# Altium project Smart_Wifi_Control_System_Rev_A.1.0.PrjPcb
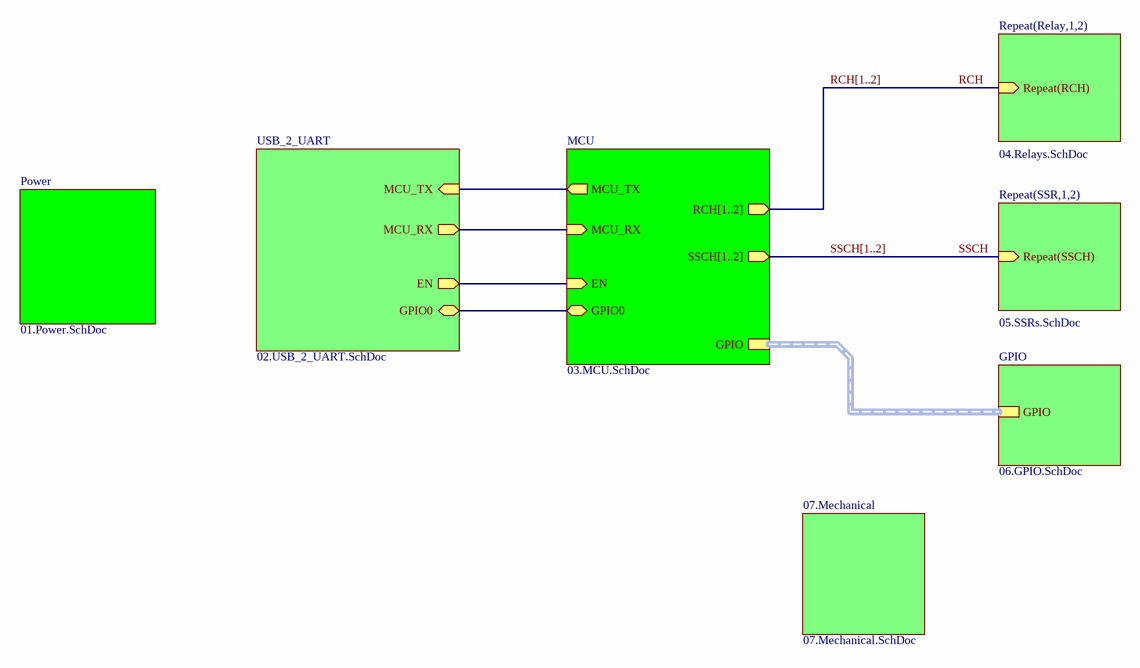
[diagram p0: 0.Main.SchDoc]
DrawnBy: H.M.K Shehan; Revision: A.1.0; Title: Smart_Wifi_Control_System_Rev_A.1.0
8 sheets, 90 parts. Net scope: hierarchical (ports join the sheet entries above them; power ports are global).
Board file: Layout_D0.PcbDoc
Sheets:
  0.Main.SchDoc
    Power = 01.Power.SchDoc
    Relay1 = 04.Relays.SchDoc
    Relay2 = 04.Relays.SchDoc
    SSR1 = 05.SSRs.SchDoc
    SSR2 = 05.SSRs.SchDoc
    USB_2_UART = 02.USB_2_UART.SchDoc
    MCU = 03.MCU.SchDoc
    GPIO = 06.GPIO.SchDoc
    07.Mechanical = 07.Mechanical.SchDoc

## Sheet 0.Main.SchDoc: Smart_Wifi_Control_System_Rev_A.1.0
size A4; DocumentNumber: 01; SheetNumber: 1; SheetTotal: 8; Page: Block Diagram

### Sub-sheets
07.Mechanical = 07.Mechanical.SchDoc: no entries
GPIO = 06.GPIO.SchDoc: GPIO (harness GPIO)
MCU = 03.MCU.SchDoc: EN (in), GPIO0 (bidir), GPIO (harness GPIO), MCU_TX (out), MCU_RX (in), RCH[1..2] (out), SSCH[1..2] (out)
Power = 01.Power.SchDoc: no entries
Repeat(Relay,1,2) = 04.Relays.SchDoc: Repeat(RCH) (in)
Repeat(SSR,1,2) = 05.SSRs.SchDoc: Repeat(SSCH) (in)
USB_2_UART = 02.USB_2_UART.SchDoc: MCU_RX (out), MCU_TX (in), EN (out), GPIO0 (bidir)

### Nets
EN: sheet USB_2_UART/EN, sheet MCU/EN
GPIO0: sheet USB_2_UART/GPIO0, sheet MCU/GPIO0
RCH: sheet Repeat(Relay,1,2)/Repeat(RCH)
RXD0: sheet USB_2_UART/MCU_RX, sheet MCU/MCU_RX
SSCH: sheet Repeat(SSR,1,2)/Repeat(SSCH)
TXD0: sheet USB_2_UART/MCU_TX, sheet MCU/MCU_TX

### Buses and harness runs
bus RCH[1..2] = sheet MCU/RCH[1..2]
bus SSCH[1..2] = sheet MCU/SSCH[1..2]
harness sheet GPIO/GPIO = sheet MCU/GPIO

### Notes on the sheet
- Title :
- Size:
- Date:
- Page :
- A4
- Number:
- Time:
- Revision:
- Sheet
- of
- Sheet Name :
- Drawn By :

## Sheet 01.Power.SchDoc: Smart_Wifi_Control_System_Rev_A.1.0
size A4; DocumentNumber: 02; SheetNumber: 2; SheetTotal: 8; Page: Power
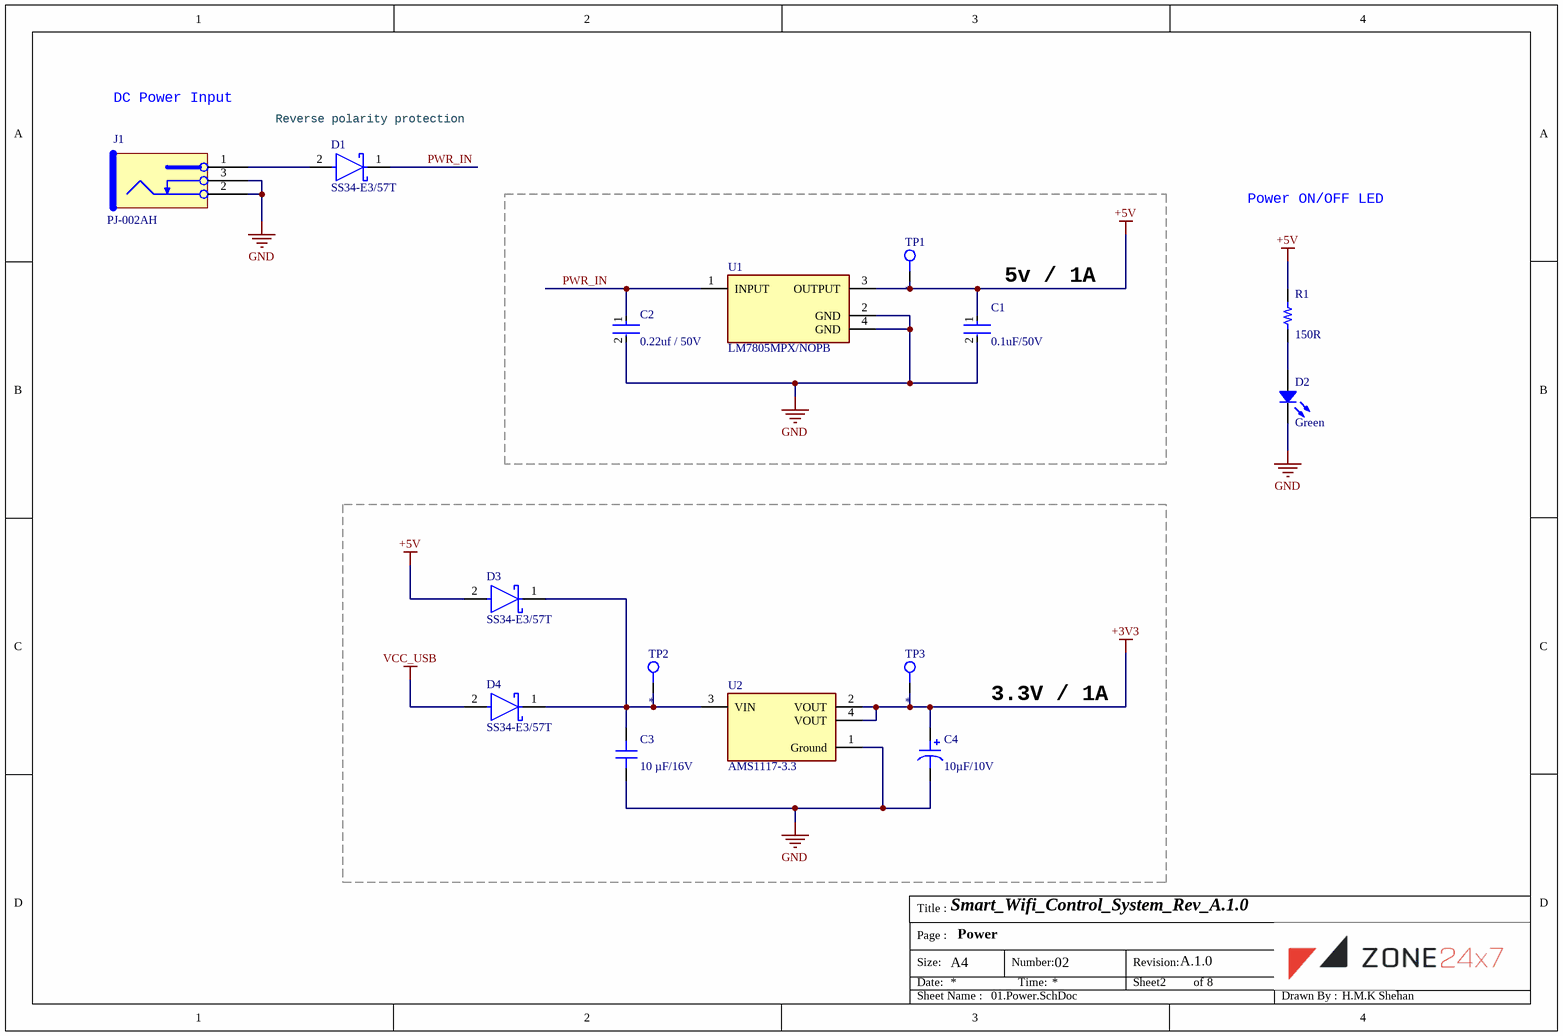
[diagram p1: 01.Power.SchDoc]

### Parts
C1  0.1uF/50V  [FP-RDE0M1-MFG]
C2  0.22uf / 50V  [FP-GRM31C-0_2-e0_3_0_8-IPC_B]
C3  10 µF/16V  [CAP 0603_1608]
C4  10µF/10V  [CAP POL 1411_3528]
D1  SS34-E3/57T  [FP-95402-MFG]
D2  Green  [LED 0805_2012 GREEN]
D3  SS34-E3/57T  [FP-95402-MFG]
D4  SS34-E3/57T  [FP-95402-MFG]
J1  PJ-002AH  [POWER_JACK_5.5_2.1MM_NS]
R1  150R  [RES 0603_1608]
TP1  *  [TP-2ED-1ID]
TP2  *  [TP-2ED-1ID]
TP3  *  [TP-2ED-1ID]
U1  LM7805MPX/NOPB  [FP-LM7805MPX-NOPB-MFG]
U2  AMS1117-3.3  [FP-AMS1117-IPC_C]

### Blocks framed on the sheet
5v / 1A: C1 C2 TP1 U1
3.3V / 1A: C3 C4 D3 D4 TP2 TP3 U2

### Nets
+3V3: C4.1 TP3.1 U2.2(VOUT) U2.4(VOUT)
+5V: C1.1 D3.2(A) R1.2 TP1.1 U1.3(OUTPUT)
GND: C1.2 C2.2 C3.1 C4.2 D2.2 J1.2 J1.3 U1.2(GND) U1.4(GND) U2.1(Ground)
VCC_USB: D4.2(A)  [project net VBUS]
PWR_IN: C2.1 D1.1(C) U1.1(INPUT)
NetC3_2: C3.2 D3.1(C) D4.1(C) TP2.1 U2.3(VIN)
NetD1_2: D1.2(A) J1.1
NetD2_1: D2.1 R1.1

### Notes on the sheet
- DC Power Input
- (near D1) Reverse polarity protection
- Power ON/OFF LED
- Title :
- Size:
- Date:
- Page :
- A4
- Number:
- Time:
- Revision:
- Sheet
- of
- Sheet Name :
- Drawn By :

### Library data of the parts
C1 = CMP-06035-051680-1: ±10% 100nF 4mm 5.5mm 5mm 50V Radial Leaded,P=5mm Ceramic Disc Capacitors ROHS; Manufacturer Part Number: RDER71H104K0M1H03A; Value: 0.1uF/50V; JLC Part Number: C527620
C2 = CMP-06035-010316-1: 50V 220nF C0G ±5% 1206 Multilayer Ceramic Capacitors MLCC - SMD/SMT ROHS; Part Number: GRM31C5C1H224JE02L; Value: 0.22uf / 50V; JLC Part Number: C464977
C3 = GRT188R61C106ME13D: 16V 10uF X5R ±20% 0603 Multilayer Ceramic Capacitors MLCC - SMD/SMT ROHS; manufacturer: Murata Electronics; Manufacturer Part Number: GRT188R61C106ME13D; Value: 10 µF/16V; JLC Part Number: C2168010
C4 = TAJB106K010TNJ: 10uF 10V 2.1Ω@100kHz ±10% 1411 Tantalum Capacitors ROHS; manufacturer: AVX Corporation; Manufacturer Part Number: TAJB106K010TNJ; Value: 10µF/10V; JLC Part Number: C1953247
D1 D3 D4 = CMP-02539-000012-1: 40V 500mV@3A 3A SMC(DO-214AB) Schottky Barrier Diodes (SBD) ROHS; Manufacturer Part Number: SS34-E3/57T; JLC Part Number: C13354
D2 = 5975316507F: 无色透明透镜 570nm -40℃~+90℃ Green-yellow 120° 0805 Light Emitting Diodes (LED) ROHS; Manufacturer Part Number: E6C0805YGAC1UDA; Manufacturer: EKINGLUX; Current - Test: 20mA; Color: Green; JLC Part Number: C375456
J1 = PJ-002AH: CONN PWR JACK 2.1X5.5MM HIGH CUR; Manufacturer Part Number: PJ-002AH; JLC Part Number: C2961147
R1 = CRCW0603150RFKEA: 100mW Thick Film Resistors 100V ±1% ±100ppm/℃ -55℃~+155℃ 150Ω 0603 Chip Resistor - Surface Mount ROHS; Manufacturer: Vishay Dale; Manufacturer Part Number: CRCW0603150RFKEA; Value: 150R; JLC Part Number: C844741
TP1-TP3 = TP-2ED-1ID: Test point-via type 2mm External diameter  1mm internal diameter; Value: *
U1 = CMP-04917-000022-1: 80dB@(120Hz) 1.5A null 5V positive 35V SOT-223-4 Linear Voltage Regulators (LDO) ROHS; Manufacturer Part Number: LM7805MPX/NOPB; ComponentLink2Description: Datasheet; ComponentLink2URL: http://www.ti.com/lit/ds/symlink/lm7800.pdf; JLC Part Number: C2848241
U2 = CMP-209535-000001-1: SOT-223 Linear Voltage Regulators (LDO) ROHS; Manufacturer: Advanced Monolithic Systems; Manufacturer Part Number: AMS1117-3.3; JLC Part Number: C6186

## Sheet 04.Relays.SchDoc: Smart_Wifi_Control_System_Rev_A.1.0
size A4; DocumentNumber: 05; SheetNumber: 5; SheetTotal: 8; Page: Relay Channels
Used 2 times, as channels Relay1, Relay2. Parts and nets are listed once, with the designators drawn on the sheet.
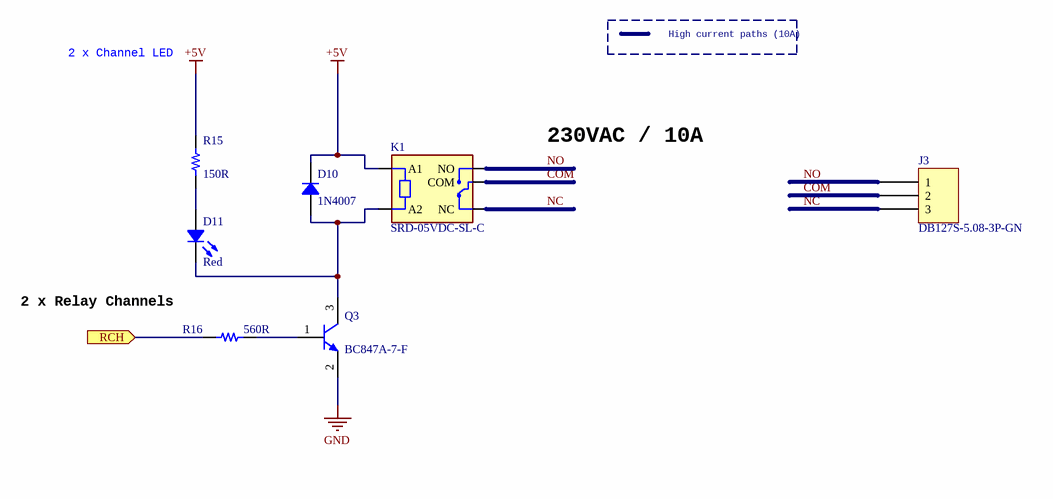
[diagram p2: 04.Relays.SchDoc]

### Parts
D10  1N4007  [DO214AC SMA]
D11  Red  [LED 0603_1608 RED]
J3  DB127S-5.08-3P-GN  [TE 282837-3]
K1  SRD-05VDC-SL-C  [RELAY_SRD-05VDC-SL-C]
Q3  BC847A-7-F  [DIODES SOT-23-3]
R15  150R  [RES 0603_1608]
R16  560R  [RES 0603_1608]

### Ports
RCH (in)

### Nets
+5V: D10.2 K1.A1 R15.2
GND: Q3.2(E)
COM: J3.2 K1.COM
NC: J3.3 K1.NC
NO: J3.1 K1.NO
RCH: R16.1 ; port RCH
NetD10_1: D10.1 D11.2 K1.A2 Q3.3(C)
NetD11_1: D11.1 R15.1
NetQ3_1: Q3.1(B) R16.2

### Channels
Relay1: designators end in _1; ports RCH=RCH1
Relay2: designators end in _2; ports RCH=RCH2

### Notes on the sheet
- High current paths (10A)
- 2 x Channel LED
- 230VAC / 10A
- 2 x Relay Channels
- Title :
- Size:
- Date:
- Page :
- A4
- Number:
- Time:
- Revision:
- Sheet
- of
- Sheet Name :
- Drawn By :

### Library data of the parts
D10 = RS1A: 1A 1.1V@1A 1kV SMA(DO-214AC) Diodes - General Purpose ROHS; Manufacturer: YONGYUTAI; Manufacturer Part Number: 1N4007; JLC Part Number: C2892673
D11 = 5973005507F: -40℃~+85℃ Red 0603 Light Emitting Diodes (LED) ROHS; Manufacturer Part Number: KT-0603R; Manufacturer: Hubei KENTO Elec; JLC Part Number: C2286
J3 = 282837-3: P=5.08mm Screw terminal ROHS; Manufacturer: DIBO; Manufacturer Part Number: DB127S-5.08-3P-GN; JLC Part Number: C2997520
K1 = SRD-05VDC-SL-C: 5V Trigger Relay Module For Arduino And Raspberry Pi 5V Trigger Relay Module For Arduino And Raspberry Pi; MF: Songle Relay; Check_prices: https://www.snapeda.com/parts/SRD-05VDC-SL-C/Songle+Relay/view-part/?ref=eda; Value: *; Availability: Not in stock; Price: None; Package: NON STANDARD-5 Songle Relay; MP: SRD-05VDC-SL-C; SnapEDA_Link: https://www.snapeda.com/parts/SRD-05VDC-SL-C/Songle+Relay/view-part/?ref=snap
Q3 = BC847A-7-F: 65V 310mW 180@2mA,5V 100mA NPN SOT-23 Bipolar Transistors - BJT ROHS; Manufacturer: Diodes Incorporated; Manufacturer Part Number: BC847A-7-F; JLC Part Number: C2760576
R15 = RC0603FR-07150RL: 100mW Thick Film Resistors ±100ppm/℃ ±1% 150Ω 0603 Chip Resistor - Surface Mount ROHS; Manufacturer: Yageo; Manufacturer Part Number: RC0603FR-07150RL; Value: 150R; JLC Part Number: C114608
R16 = CRGP0603F560R: 100mW ±100ppm/℃ ±1% 560Ω 0603 Chip Resistor - Surface Mount ROHS; Manufacturer Part Number: RS-03K5600FT; Manufacturer: FH (Guangdong Fenghua Advanced Tech); Value: 560R; JLC Part Number: C136586

## Sheet 05.SSRs.SchDoc: Smart_Wifi_Control_System_Rev_A.1.0
size A4; SPICEModelCache: <root> / <DocumentId>WVACCUDR</DocumentId> / <CacheFrame Number="0"> / <Model Name="cap" Kind="MDL"> / <Text>*Default semiconductor capacitor / .MODEL CAP C()</Text> / </Model> / </CacheFrame> / </root>; DocumentNumber: 06; SheetNumber: 6; SheetTotal: 8; Page: SSR Channels
Used 2 times, as channels SSR1, SSR2. Parts and nets are listed once, with the designators drawn on the sheet.
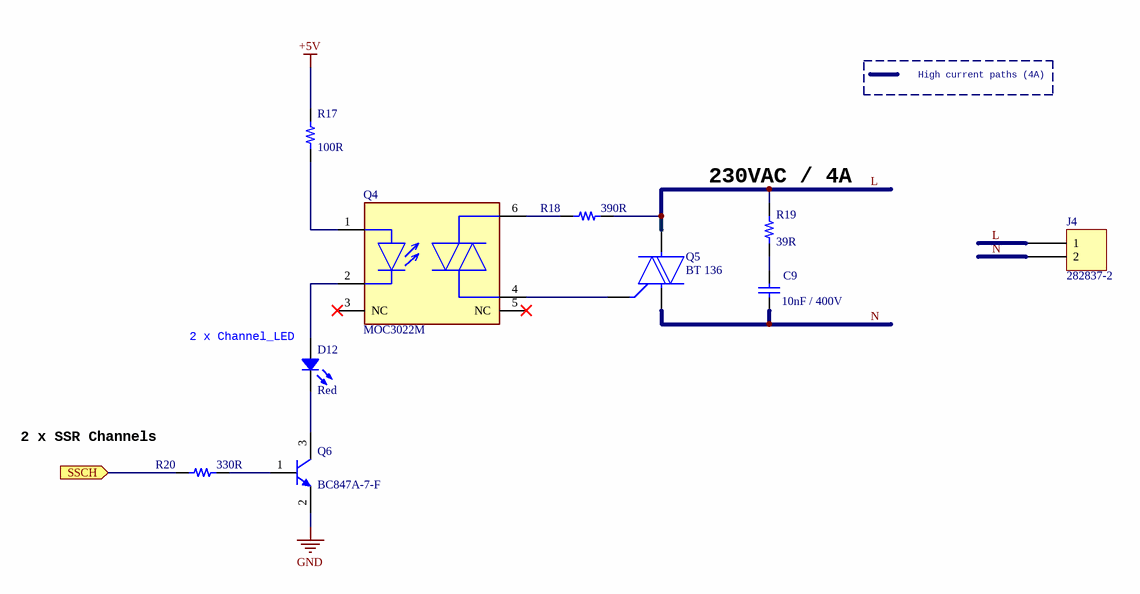
[diagram p3: 05.SSRs.SchDoc]

### Parts
C9  10nF / 400V  [CAPRR1000W60L1200T500H830]
D12  Red  [LED 0603_1608 RED]
J4  282837-2  [TE 282837-2]
Q4  MOC3022M  [FP-646BY-MFG]
Q5  BT 136  [FP-TO-220AB_Ins-MFG]
Q6  BC847A-7-F  [DIODES SOT-23-3]
R17  100R  [RES 0603_1608]
R18  390R  [RES 1206_3216]
R19  39R  [RES 1210_3225]
R20  330R  [RES 0603_1608]

### Ports
SSCH (in)

### Nets
+5V: R17.2
GND: Q6.2(E)
L: J4.1 Q5.2(A2) R18.2 R19.2
N: C9.2 J4.2 Q5.1(A1)
SSCH: R20.1 ; port SSCH
NetC9_1: C9.1 R19.1
NetD12_1: D12.1 Q4.2(C)
NetD12_2: D12.2 Q6.3(C)
NetQ4_1: Q4.1(A) R17.1
NetQ4_4: Q4.4(1_MAIN_TERM.) Q5.3(G)
NetQ4_6: Q4.6(2_MAIN_TERM.) R18.1
NetQ6_1: Q6.1(B) R20.2

Not connected (* = marked no-connect by the designer): Q4 3(NC)* 5(NC)*

### Channels
SSR1: designators end in _1; ports SSCH=SSCH1
SSR2: designators end in _2; ports SSCH=SSCH2

### Notes on the sheet
- High current paths (4A)
- (near R19) 230VAC / 4A
- (near D12) 2 x Channel_LED
- 2 x SSR Channels
- Title :
- Size:
- Date:
- Page :
- A4
- Number:
- Time:
- Revision:
- Sheet
- of
- Sheet Name :
- Drawn By :

### Library data of the parts
C9 = Cap: 10nF ±5% 400V Plugin,P=10mm Polypropylene Film Capacitors (CBB) ROHS; Manufacturer Part Number: CFC2G103JE1J12075100; Manufacturer: Dersonic; JLC Part Number: C2681665; Value: 10nF / 400V
D12 = 5973005507F: as D11 on sheet 04.Relays; JLC Part Number: C2286
J4 = 282837-2: TERM BLK 2P SIDE ENT 5.08MM PCB; Manufacturer: TE Connectivity AMP Connectors; Manufacturer Part Number: 282837-2; JLC Part Number: C592976
Q4 = CMP-00278-84330365-1: 60mA 400V 1.15V Two-way thyristor DIP-6 Optocouplers - Thyristor Signal Output ROHS; Manufacturer: UMW(Youtai Semiconductor Co., Ltd.); Part Number: MOC3022M; JLC Part Number: C2842958
Q5 = CMP-12193-000006-1: 1W 4A 27A 1个双向可控硅 TO-220 TRIACs ROHS; Manufacturer: KY; Manufacturer Part Number: BT136-800E; JLC Part Number: C2831690
Q6 = BC847A-7-F: as Q3 on sheet 04.Relays; Manufacturer Part Number: BC847A-7-F; JLC Part Number: C2760576
R17 = CRCW0603100RJNEAIF: 100mW Thick Film Resistors ±5% ±200ppm/℃ 100Ω 0603 Chip Resistor - Surface Mount ROHS; Manufacturer Part Number: TR0603D100RP0550Z; Manufacturer: Ever Ohms Tech; Value: 100R; JLC Part Number: C5250752
R18 = RT1206BRD07150RL: 250mW Thick Film Resistors ±100ppm/℃ ±5% 390Ω 1206 Chip Resistor - Surface Mount ROHS; Manufacturer Part Number: 1206W4J0391T5E; Manufacturer: UNI-ROYAL(Uniroyal Elec); Value: 390R; JLC Part Number: C25378
R19 = RK73B2ETTD471J: 750mW Thick Film Resistors ±5% ±200ppm/℃ 39Ω 1210 Chip Resistor - Surface Mount ROHS; Manufacturer Part Number: CR1210J30390G; Manufacturer: LIZ Elec; Value: 39R; JLC Part Number: C102462
R20 = CRGP0603F560R: 100mW Thick Film Resistors ±100ppm/℃ ±1% 330Ω 0603 Chip Resistor - Surface Mount ROHS; Manufacturer Part Number: 0603WAF3300T5E; Manufacturer: UNI-ROYAL(Uniroyal Elec); Value: 330R; JLC Part Number: C23138

## Sheet 02.USB_2_UART.SchDoc: Smart_Wifi_Control_System_Rev_A.1.0
size A4; DocumentNumber: 03; SheetNumber: 3; SheetTotal: 8; Page: USB to UART
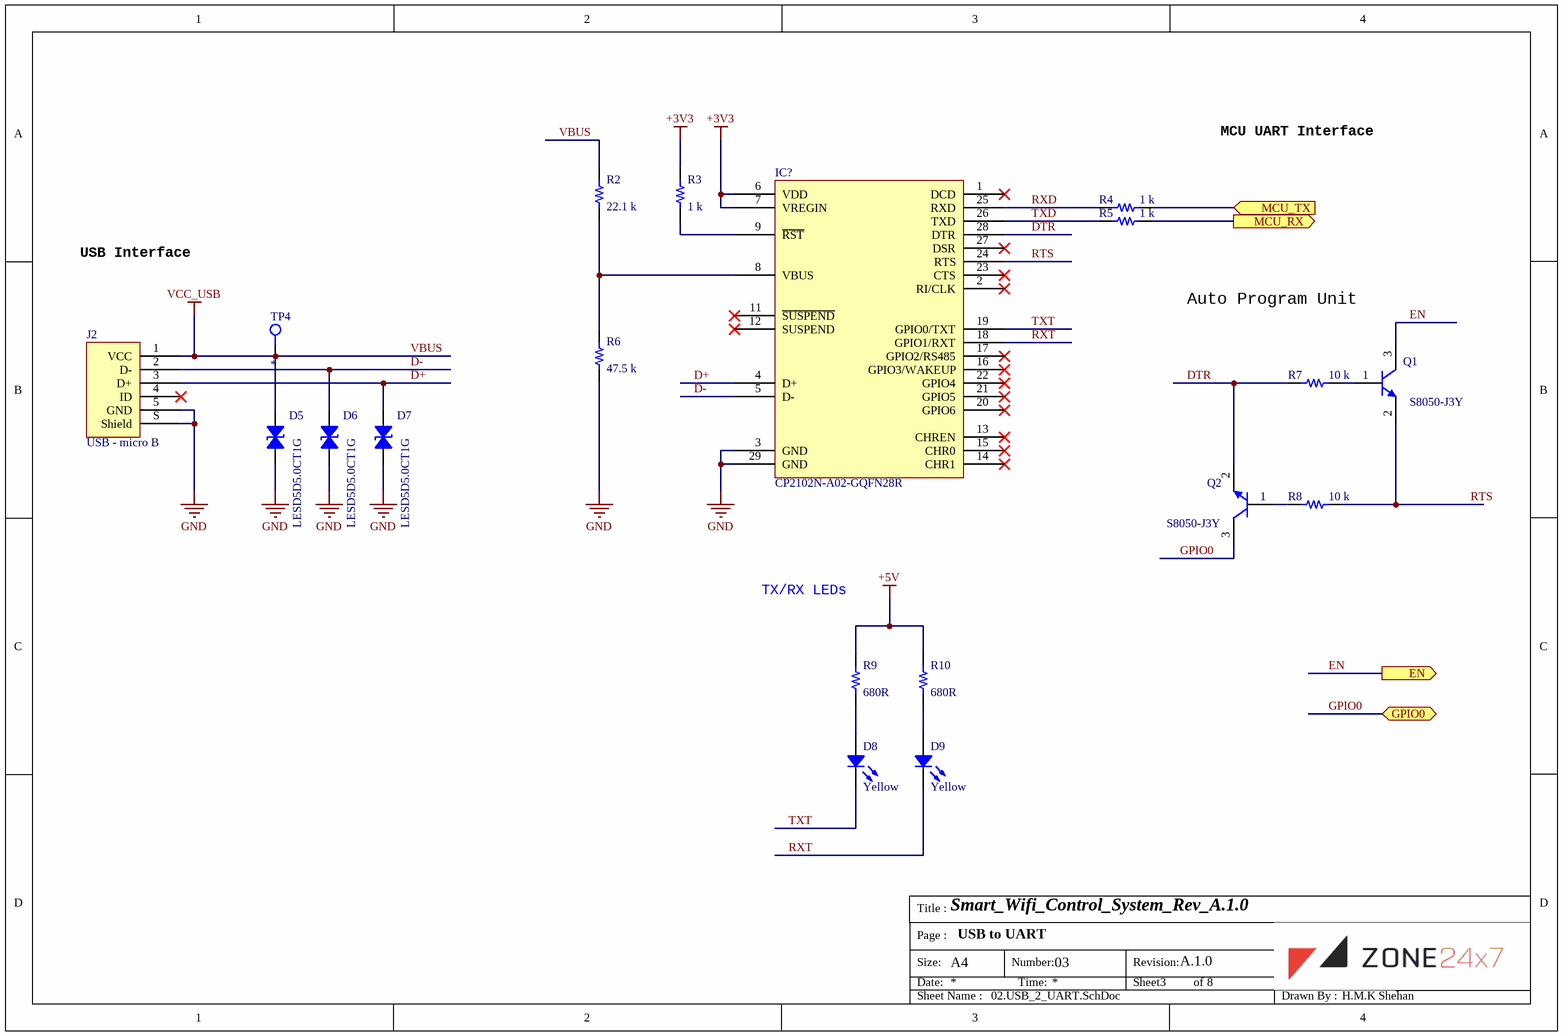
[diagram p4: 02.USB_2_UART.SchDoc]

### Parts
D5  LESD5D5.0CT1G  [SOD-523]
D6  LESD5D5.0CT1G  [SOD-523]
D7  LESD5D5.0CT1G  [SOD-523]
D8  Yellow  [LED 0603_1608 YELLOW]
D9  Yellow  [LED 0603_1608 YELLOW]
IC?  CP2102N-A02-GQFN28R  [IC_CP2102N-A02-GQFN28R]
J2  USB - micro B  [FCI USB 10118193-0001LF]
Q1  S8050-J3Y  [DIODES SOT-23-3]
Q2  S8050-J3Y  [DIODES SOT-23-3]
R2  22.1 k  [RES 0603_1608]
R3  1 k  [RES 0603_1608]
R4  1 k  [RES 0603_1608]
R5  1 k  [RES 0603_1608]
R6  47.5 k  [RES 0603_1608]
R7  10 k  [RES 0603_1608]
R8  10 k  [RES 0603_1608]
R9  680R  [RES 0603_1608]
R10  680R  [RES 0603_1608]
TP4  *  [TP-2ED-1ID]

### Ports
EN (out), GPIO0 (bidir), MCU_RX (out), MCU_TX (in)

### Nets
+3V3: IC?.6(VDD) IC?.7(VREGIN) R3.2
+5V: R9.2 R10.2
GND: D5.1 D6.1 D7.1 IC?.3(GND) IC?.29(GND) J2.5(GND) J2.S(Shield) R6.1
VBUS: D5.2 J2.1(VCC) R2.1 TP4.1  [also labelled VCC_USB]
D+: D7.2 IC?.4(D+) J2.3(D+)
D-: D6.2 IC?.5(D-) J2.2(D-)
DTR: IC?.28(DTR) Q2.2(E) R7.2
EN: Q1.3(C) ; port EN
GPIO0: Q2.3(C) ; port GPIO0
RTS: IC?.24(RTS) Q1.2(E) R8.1
RXD: IC?.25(RXD) R4.2
RXD0: R5.1 ; port MCU_RX
RXT: D9.2 IC?.18(GPIO1/RXT)
TXD: IC?.26(TXD) R5.2
TXD0: R4.1 ; port MCU_TX
TXT: D8.2 IC?.19(GPIO0/TXT)
NetD8_1: D8.1 R9.1
NetD9_1: D9.1 R10.1
NetIC?_8: IC?.8(VBUS) R2.2 R6.2
NetIC?_9: IC?.9(~{RST}) R3.1
NetQ1_1: Q1.1(B) R7.1
NetQ2_1: Q2.1(B) R8.2

Not connected (* = marked no-connect by the designer): IC? 1(DCD)* 2(RI/CLK)* 11(~{SUSPEND})* 12(SUSPEND)* 13(CHREN)* 14(CHR1)* 15(CHR0)* 16(GPIO3/WAKEUP)* 17(GPIO2/RS485)* 20(GPIO6)* 21(GPIO5)* 22(GPIO4)* 23(CTS)* 27(DSR)*; J2 4(ID)*

### Notes on the sheet
- MCU UART Interface
- USB Interface
- Auto Program Unit
- TX/RX LEDs
- Title :
- Size:
- Date:
- Page :
- A4
- Number:
- Time:
- Revision:
- Sheet
- of
- Sheet Name :
- Drawn By :

### Library data of the parts
D5-D7 = Diode TVS: 5.6V 18.6V 5V Bi-Directional SOD-523  ESD Protection Devices ROHS; Manufacturer: LRC; Manufacturer Part Number: LESD5D5.0CT1G; JLC Part Number: C383211
D8 D9 = 5990040007F: 无色透明透镜 -40℃~+85℃ 572nm Green-yellow 120° 60mW 0603 Light Emitting Diodes (LED) ROHS; Manufacturer Part Number: MHT192JGCT; Manufacturer: MEIHUA; JLC Part Number: C473820
IC? = Silicon Labs - CP2102N QFN28: USB转UART UART QFN-28-EP(5x5) USB ICs ROHS; Manufacturer Part Number: CP2102N-A02-GQFN28R; Manufacturer: Silicon Labs; JLC Part Number: C964632
J2 = 10118193-0001LF: USB 2.0 1 Surface Mount 5P Female -30℃~+80℃ Micro-B SMD USB Connectors ROHS; Manufacturer Part Number: MicroQTJ; Manufacturer: SHOU HAN; Specifications: USB 2.0; Connector Type: USB - micro B; JLC Part Number: C404968
Q1 Q2 = BCX41TA: 25V 300mW 500mA NPN SOT-23 Bipolar Transistors - BJT ROHS; Manufacturer: MDD; Manufacturer Part Number: S8050-J3Y; JLC Part Number: C364312
R2 = RMCF0603FT22K1: 100mW ±100ppm/℃ ±1% 22.1kΩ 0603 Chip Resistor - Surface Mount ROHS; Manufacturer Part Number: RS-03K2212FT; Manufacturer: FH (Guangdong Fenghua Advanced Tech); Value: 22.1 k; JLC Part Number: C310274
R3-R5 = CPF0603B1K0E: 100mW ±100ppm/℃ ±1% 1kΩ 0603 Chip Resistor - Surface Mount ROHS; Manufacturer Part Number: RTT031001FTP; Value: 1 k; JLC Part Number: C103198
R6 = ERJ-PB3B4752V: 100mW Thick Film Resistors ±100ppm/℃ ±1% 47.5kΩ 0603 Chip Resistor - Surface Mount ROHS; Manufacturer Part Number: WR06X4752FTL; Manufacturer: Walsin Tech Corp; Value: 47.5 k; JLC Part Number: C168326
R7 R8 = CPF0603B1K0E: 100mW Thick Film Resistors ±100ppm/℃ ±5% 10kΩ 0603 Chip Resistor - Surface Mount ROHS; Manufacturer Part Number: RTT03103JTP; Manufacturer: RALEC; Value: 10 k; JLC Part Number: C103210
R9 R10 = CRCW0603150RFKEA: 100mW Thick Film Resistors ±100ppm/℃ ±1% 680Ω 0603 Chip Resistor - Surface Mount ROHS; Manufacturer Part Number: RC0603FR-07680RL; Manufacturer: YAGEO; Value: 680R; JLC Part Number: C112310
TP4 = TP-2ED-1ID: as TP1 on sheet 01.Power; Value: *

## Sheet 03.MCU.SchDoc: Smart_Wifi_Control_System_Rev_A.1.0
size A4; DocumentNumber: 04; SheetNumber: 4; SheetTotal: 8; Page: MCU
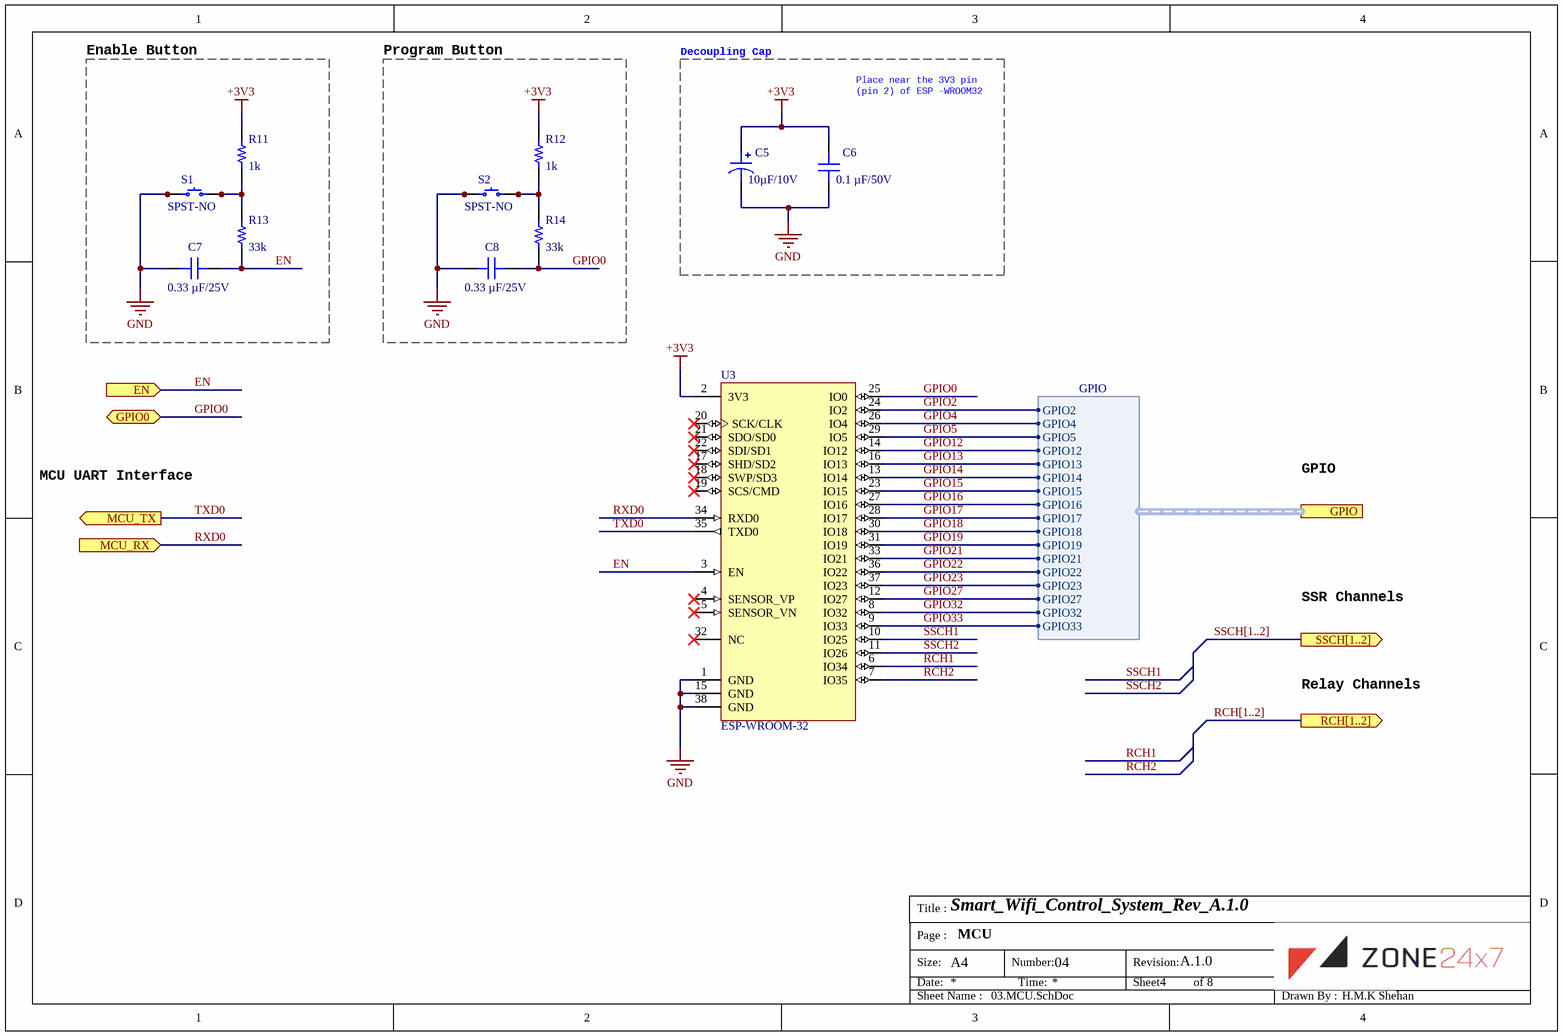
[diagram p5: 03.MCU.SchDoc]

### Parts
C5  10µF/10V  [CAP POL 1411_3528]
C6  0.1 µF/50V  [CAP 0805_2012]
C7  0.33 µF/25V  [CAP 0603_1608]
C8  0.33 µF/25V  [CAP 0603_1608]
R11  1k  [RES 0603_1608]
R12  1k  [RES 0603_1608]
R13  33k  [RES 0603_1608]
R14  33k  [RES 0603_1608]
S1  SPST-NO  [TE FSM4JSMA]
S2  SPST-NO  [TE FSM4JSMA]
U3  ESP-WROOM-32  [OLMX-ESP-WROOM-32]

### Blocks framed on the sheet
Enable Button: C7 R11 R13 S1
Program Button: C8 R12 R14 S2
Decoupling Cap: C5 C6

### Ports
EN (in), GPIO0 (bidir), GPIO (harness GPIO), MCU_RX (in), MCU_TX (out), RCH[1..2] (out), SSCH[1..2] (out)

### Harnesses
GPIO: GPIO2, GPIO4, GPIO5, GPIO12, GPIO13, GPIO14, GPIO15, GPIO16, GPIO17, GPIO18, GPIO19, GPIO21, GPIO22, GPIO23, GPIO27, GPIO32, GPIO33

### Nets
+3V3: C5.1 C6.2 R11.2 R12.2 U3.2(3V3)
GND: C5.2 C6.1 C7.2 C8.2 S1.1 S1.2 S2.1 S2.2 U3.1(GND) U3.15(GND) U3.38(GND)
EN: C7.1 R13.1 U3.3(EN) ; port EN
GPIO0: C8.1 R14.1 U3.25(IO0) ; port GPIO0
GPIO2: U3.24(IO2) ; port GPIO.GPIO2
GPIO4: U3.26(IO4) ; port GPIO.GPIO4
GPIO5: U3.29(IO5) ; port GPIO.GPIO5
GPIO12: U3.14(IO12) ; port GPIO.GPIO12
GPIO13: U3.16(IO13) ; port GPIO.GPIO13
GPIO14: U3.13(IO14) ; port GPIO.GPIO14
GPIO15: U3.23(IO15) ; port GPIO.GPIO15
GPIO16: U3.27(IO16) ; port GPIO.GPIO16
GPIO17: U3.28(IO17) ; port GPIO.GPIO17
GPIO18: U3.30(IO18) ; port GPIO.GPIO18
GPIO19: U3.31(IO19) ; port GPIO.GPIO19
GPIO21: U3.33(IO21) ; port GPIO.GPIO21
GPIO22: U3.36(IO22) ; port GPIO.GPIO22
GPIO23: U3.37(IO23) ; port GPIO.GPIO23
GPIO27: U3.12(IO27) ; port GPIO.GPIO27
GPIO32: U3.8(IO32) ; port GPIO.GPIO32
GPIO33: U3.9(IO33) ; port GPIO.GPIO33
RCH1: U3.6(IO34)
RCH2: U3.7(IO35)
RXD0: U3.34(RXD0) ; port MCU_RX
SSCH1: U3.10(IO25)
SSCH2: U3.11(IO26)
TXD0: U3.35(TXD0) ; port MCU_TX
NetR11_1: R11.1 R13.2 S1.3 S1.4
NetR12_1: R12.1 R14.2 S2.3 S2.4

Not connected (* = marked no-connect by the designer): U3 4(SENSOR_VP)* 5(SENSOR_VN)* 17(SHD/SD2)* 18(SWP/SD3)* 19(SCS/CMD)* 20(SCK/CLK)* 21(SDO/SD0)* 22(SDI/SD1)* 32(NC)*

### Buses and harness runs
bus RCH[1..2] = port RCH[1..2]
bus SSCH[1..2] = port SSCH[1..2]

### Notes on the sheet
- (near C6) Place near the 3V3 pin (pin 2) of ESP -WROOM32
- MCU UART Interface
- GPIO
- SSR Channels
- Relay Channels
- Title :
- Size:
- Date:
- Page :
- A4
- Number:
- Time:
- Revision:
- Sheet
- of
- Sheet Name :
- Drawn By :

### Library data of the parts
C5 = TAJB106K010TNJ: as C4 on sheet 01.Power; Manufacturer Part Number: TAJB106K010TNJ; Value: 10µF/10V; JLC Part Number: C1953247
C6 = CC0805MRX7R9BB104: 50V 100nF 2X1 ±10% 0805 Multilayer Ceramic Capacitors MLCC - SMD/SMT ROHS; Manufacturer Part Number: CT41G-0805-2X1-50V-0.1μF-K(N); manufacturer: TORCH; Value: 0.1 µF/50V; JLC Part Number: C126469
C7 C8 = CC0603KRX7R7BB334: 25V 330nF X7R ±10% 0603 Multilayer Ceramic Capacitors MLCC - SMD/SMT ROHS; Manufacturer Part Number: CC0603KRX7R8BB334; manufacturer: Yageo; Value: 0.33 µF/25V; JLC Part Number: C107070
R11 R12 = CRCW0603150RFKEA: 100mW ±100ppm/℃ ±1% 1kΩ 0603 Chip Resistor - Surface Mount ROHS; Manufacturer Part Number: RTT031001FTP; Manufacturer: RALEC; Value: 1k; JLC Part Number: C103198
R13 R14 = CRCW0603150RFKEA: 100mW ±100ppm/℃ ±1% 33kΩ 0603 Chip Resistor - Surface Mount ROHS; Manufacturer Part Number: RTT033302FTP; Manufacturer: RALEC; Value: 33k; JLC Part Number: C103544
S1 S2 = FSM4JSMATR: SWITCH TACTILE SPST-NO 0.05A 24V; Manufacturer: TE Connectivity ALCOSWITCH Switches; Manufacturer Part Number: FSM4JSMATR; JLC Part Number: *
U3 = OLMX-ESP-WROOM-32-38: SMD,18x25.5mm WiFi Modules ROHS; Manufacturer: Espressif Systems; Manufacturer Part Number: ESP32-WROOM-32-N4; JLC Part Number: C82899

## Sheet 06.GPIO.SchDoc: Smart_Wifi_Control_System_Rev_A.1.0
size A4; DocumentNumber: 07; SheetNumber: 7; SheetTotal: 8; Page: GPIO
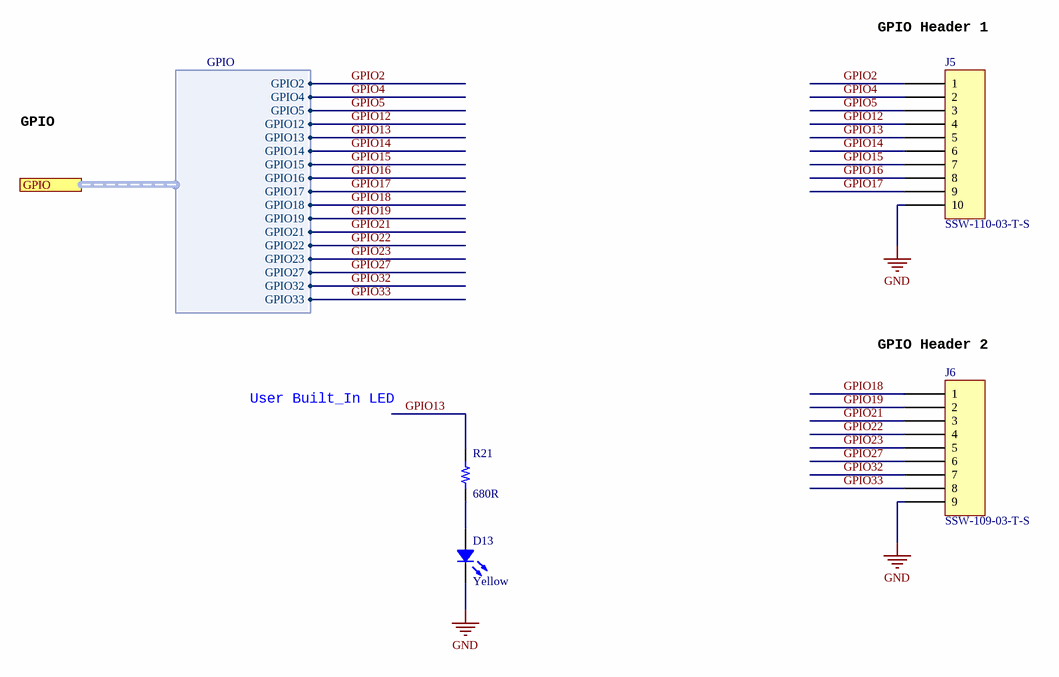
[diagram p6: 06.GPIO.SchDoc]

### Parts
D13  Yellow  [LED 0603_1608 YELLOW]
J5  SSW-110-03-T-S  [SAMTEC SSW-110-03-T-S]
J6  SSW-109-03-T-S  [SAMTEC SSW-109-03-T-S]
R21  680R  [RES 0603_1608]

### Ports
GPIO (harness GPIO)

### Harnesses
GPIO: GPIO2, GPIO4, GPIO5, GPIO12, GPIO13, GPIO14, GPIO15, GPIO16, GPIO17, GPIO18, GPIO19, GPIO21, GPIO22, GPIO23, GPIO27, GPIO32, GPIO33

### Nets
GND: D13.2 J5.10 J6.9
GPIO2: J5.1 ; port GPIO.GPIO2
GPIO4: J5.2 ; port GPIO.GPIO4
GPIO5: J5.3 ; port GPIO.GPIO5
GPIO12: J5.4 ; port GPIO.GPIO12
GPIO13: J5.5 R21.2 ; port GPIO.GPIO13
GPIO14: J5.6 ; port GPIO.GPIO14
GPIO15: J5.7 ; port GPIO.GPIO15
GPIO16: J5.8 ; port GPIO.GPIO16
GPIO17: J5.9 ; port GPIO.GPIO17
GPIO18: J6.1 ; port GPIO.GPIO18
GPIO19: J6.2 ; port GPIO.GPIO19
GPIO21: J6.3 ; port GPIO.GPIO21
GPIO22: J6.4 ; port GPIO.GPIO22
GPIO23: J6.5 ; port GPIO.GPIO23
GPIO27: J6.6 ; port GPIO.GPIO27
GPIO32: J6.7 ; port GPIO.GPIO32
GPIO33: J6.8 ; port GPIO.GPIO33
NetD13_1: D13.1 R21.1

### Notes on the sheet
- (near J5) GPIO Header 1
- GPIO
- (near J6) GPIO Header 2
- User Built_In LED
- Title :
- Size:
- Date:
- Page :
- A4
- Number:
- Time:
- Revision:
- Sheet
- of
- Sheet Name :
- Drawn By :

### Library data of the parts
D13 = 5990040007F: as D8 on sheet 02.USB_2_UART; JLC Part Number: C473820
J5 = SSW-110-03-T-S: CONN RCPT 10POS 0.1 TIN PCB; Manufacturer: Samtec Inc.; Manufacturer Part Number: SSW-110-03-T-S; JLC Part Number: C3322776
J6 = SSW-109-03-T-S: CONN RCPT 9POS 0.1 TIN PCB; Manufacturer: Samtec Inc.; Manufacturer Part Number: SSW-109-03-T-S; JLC Part Number: *
R21 = CRCW0603150RFKEA: as R9 on sheet 02.USB_2_UART; Value: 680R; JLC Part Number: C112310

## Sheet 07.Mechanical.SchDoc: Smart_Wifi_Control_System_Rev_A.1.0
size A4; DocumentNumber: 08; SheetNumber: 8; SheetTotal: 8; Page: Mechanical parts
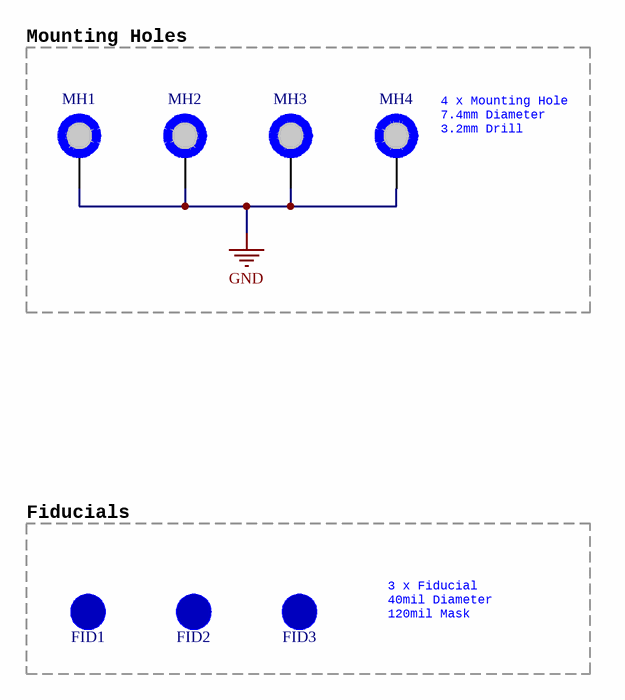
[diagram p7: 07.Mechanical.SchDoc]

### Parts
FID1  FID_1MMC  [FID_40X120D]  (value not drawn)  (no BOM)
FID2  FID_1MMC  [FID_40X120D]  (value not drawn)  (no BOM)
FID3  FID_1MMC  [FID_40X120D]  (value not drawn)  (no BOM)
MH1  MH_7.4MMC_3.2MMD  [MH_7.4MMD_3.2MMD_VIA_SUPPORT]  (value not drawn)  (no BOM)
MH2  MH_7.4MMC_3.2MMD  [MH_7.4MMD_3.2MMD_VIA_SUPPORT]  (value not drawn)  (no BOM)
MH3  MH_7.4MMC_3.2MMD  [MH_7.4MMD_3.2MMD_VIA_SUPPORT]  (value not drawn)  (no BOM)
MH4  MH_7.4MMC_3.2MMD  [MH_7.4MMD_3.2MMD_VIA_SUPPORT]  (value not drawn)  (no BOM)

### Blocks framed on the sheet
Mounting Holes: MH1-MH4
Fiducials: FID1-FID3

### Nets
GND: MH1.1 MH2.1 MH3.1 MH4.1

### Notes on the sheet
- (near MH4) 4 x Mounting Hole
  7.4mm Diameter
  3.2mm Drill
- 3 x Fiducial 40mil Diameter 120mil Mask
- Title :
- Size:
- Date:
- Page :
- A4
- Number:
- Time:
- Revision:
- Sheet
- of
- Sheet Name :
- Drawn By :

### Library data of the parts
FID1-FID3 = FID_1MMC: Fiducial 40mil Diameter, 120mil Mask; Supplier: Digikey
MH1-MH4 = MH_7.4MMC_3.2MMD: Mounting Hole 7.4mm Diameter, 3.2mm Drill

## Nets that join several sheets
+3V3: 01.Power (C4.1 TP3.1 U2.2 U2.4), 02.USB_2_UART (IC?.6 IC?.7 R3.2), 03.MCU (5 pins)
+5V: 01.Power (5 pins), Relay1 (D10_1.2 K1_1.A1 R15_1.2), Relay2 (D10_2.2 K1_2.A1 R15_2.2), SSR1 (R17_1.2), SSR2 (R17_2.2), 02.USB_2_UART (R9.2 R10.2)
GND: 01.Power (10 pins), Relay1 (Q3_1.2), Relay2 (Q3_2.2), SSR1 (Q6_1.2), SSR2 (Q6_2.2), 02.USB_2_UART (8 pins), 03.MCU (11 pins), 06.GPIO (D13.2 J5.10 J6.9), 07.Mechanical (MH1.1 MH2.1 MH3.1 MH4.1)
VBUS: 01.Power (D4.2), 02.USB_2_UART (D5.2 J2.1 R2.1 TP4.1)
EN: 02.USB_2_UART (Q1.3), 03.MCU (C7.1 R13.1 U3.3)
GPIO0: 02.USB_2_UART (Q2.3), 03.MCU (C8.1 R14.1 U3.25)
GPIO2: 03.MCU (U3.24), 06.GPIO (J5.1)
GPIO4: 03.MCU (U3.26), 06.GPIO (J5.2)
GPIO5: 03.MCU (U3.29), 06.GPIO (J5.3)
GPIO12: 03.MCU (U3.14), 06.GPIO (J5.4)
GPIO13: 03.MCU (U3.16), 06.GPIO (J5.5 R21.2)
GPIO14: 03.MCU (U3.13), 06.GPIO (J5.6)
GPIO15: 03.MCU (U3.23), 06.GPIO (J5.7)
GPIO16: 03.MCU (U3.27), 06.GPIO (J5.8)
GPIO17: 03.MCU (U3.28), 06.GPIO (J5.9)
GPIO18: 03.MCU (U3.30), 06.GPIO (J6.1)
GPIO19: 03.MCU (U3.31), 06.GPIO (J6.2)
GPIO21: 03.MCU (U3.33), 06.GPIO (J6.3)
GPIO22: 03.MCU (U3.36), 06.GPIO (J6.4)
GPIO23: 03.MCU (U3.37), 06.GPIO (J6.5)
GPIO27: 03.MCU (U3.12), 06.GPIO (J6.6)
GPIO32: 03.MCU (U3.8), 06.GPIO (J6.7)
GPIO33: 03.MCU (U3.9), 06.GPIO (J6.8)
RCH1: Relay1 (R16_1.1), 03.MCU (U3.6)
RCH2: Relay2 (R16_2.1), 03.MCU (U3.7)
RXD0: 02.USB_2_UART (R5.1), 03.MCU (U3.34)
SSCH1: SSR1 (R20_1.1), 03.MCU (U3.10)
SSCH2: SSR2 (R20_2.1), 03.MCU (U3.11)
TXD0: 02.USB_2_UART (R4.1), 03.MCU (U3.35)